# Altium project tsPico.PrjPcb
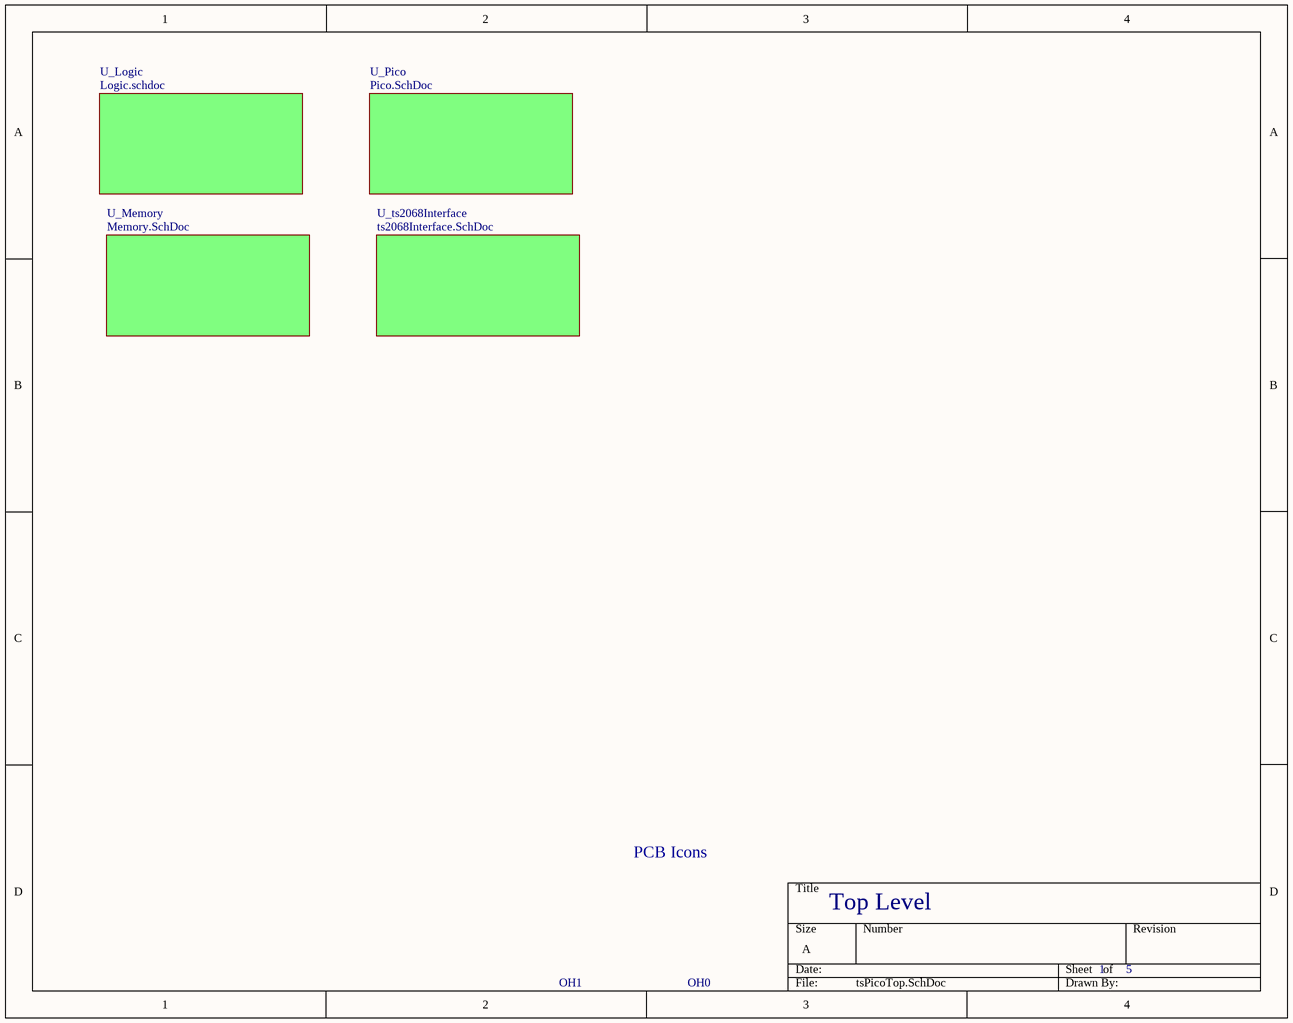
[diagram p0: tsPicoTop.SchDoc]
5 sheets, 38 parts. Net scope: global (net labels, ports and power ports of the same name join across sheets).
Sheets:
  tsPicoTop.SchDoc
    U_Logic = Logic.schdoc
    U_Memory = Memory.SchDoc
    U_Pico = Pico.SchDoc
    U_ts2068Interface = ts2068Interface.SchDoc

## Sheet tsPicoTop.SchDoc
size A; SheetNumber: 1; SheetTotal: 5

### Parts
OH0  OPENHW_PCB  [OpenHW]  (value not drawn)
OH1  OPENHW_SCH  (value not drawn)

### Sub-sheets
U_Logic = Logic.schdoc: no entries
U_Memory = Memory.SchDoc: no entries
U_Pico = Pico.SchDoc: no entries
U_ts2068Interface = ts2068Interface.SchDoc: no entries

### Notes on the sheet
- PCB Icons
- Top Level

## Sheet Logic.schdoc
size A; SheetNumber: 3; SheetTotal: 5
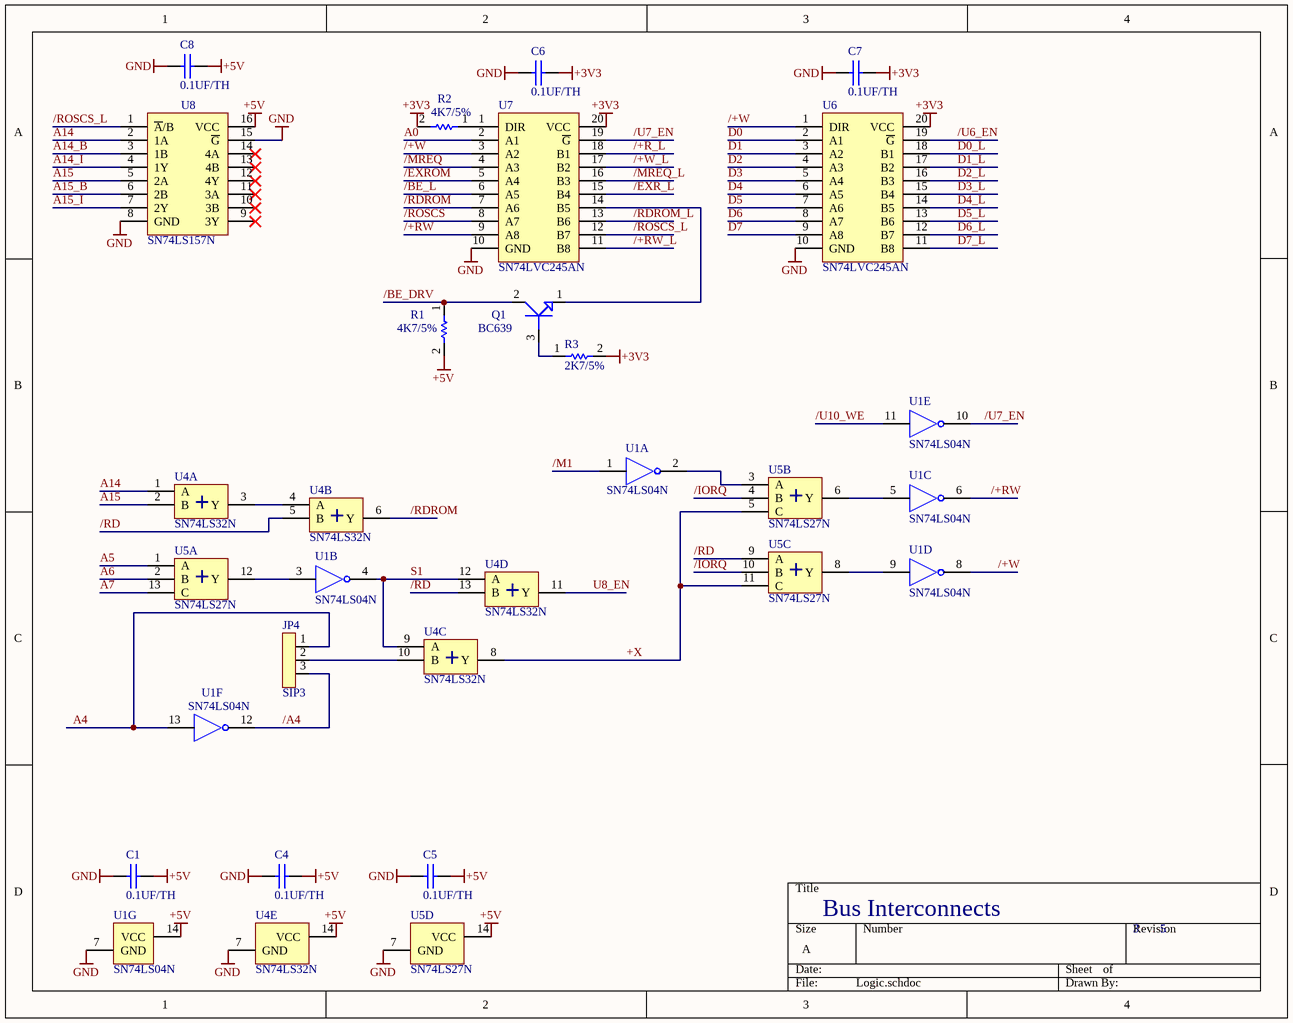
[diagram p1: Logic.schdoc]

### Parts
C1  0.1UF/TH  [CAPH5]
C4  0.1UF/TH  [CAPH5]
C5  0.1UF/TH  [CAPH5]
C6  0.1UF/TH  [CAPH5]
C7  0.1UF/TH  [CAPH5]
C8  0.1UF/TH  [CAPH5]
JP4  SIP3  [SIP3]
Q1  BC639  [TO92]
R1  4K7/5%  [CF18]
R2  4K7/5%  [CF18]
R3  2K7/5%  [CF18]
U1  SN74LS04N  [dip14]  (parts A,B,C,D,E,F,G of 7)
U4  SN74LS32N  [dip14]  (parts A,B,C,D,E of 5)
U5  SN74LS27N  [dip14]  (parts A,B,C,D of 4)
U6  SN74LVC245AN  [DIP20]
U7  SN74LVC245AN  [DIP20]
U8  SN74LS157N  [DIP16]

### Nets
+3V3: C6.2 C7.2 R2.2 R3.2 U6.20(VCC) U7.20(VCC)
+5V: C1.2 C4.2 C5.2 C8.2 R1.2 U1.14(VCC) U4.14(VCC) U5.14(VCC) U8.16(VCC)
GND: C1.1 C4.1 C5.1 C6.1 C7.1 C8.1 U1.7(GND) U4.7(GND) U5.7(GND) U6.10(GND) U7.10(GND) U8.8(GND) U8.15(~{G})
+X: U4.8(Y) U5.5(C) U5.11(C)
/+R_L: U7.18(B1)
/+RW: U1.6 U7.9(A8)
/+RW_L: U7.11(B8)
/+W: U1.8 U6.1(DIR) U7.3(A2)
/+W_L: U7.17(B2)
/A4: JP4.3 U1.12
/BE_DRV: Q1.2(COLLECTOR) R1.1
/BE_L: U7.6(A5)
/EXR_L: U7.15(B4)
/EXROM: U7.5(A4)
/IORQ: U5.4(B) U5.10(B)
/M1: U1.1
/MREQ: U7.4(A3)
/MREQ_L: U7.16(B3)
/RD: U4.5(B) U4.13(B) U5.9(A)
/RDROM: U4.6(Y) U7.7(A6)
/RDROM_L: U7.13(B6)
/ROSCS: U7.8(A7)
/ROSCS_L: U7.12(B7) U8.1(~{A}/B)
/U6_EN: U6.19(~{G})
/U7_EN: U1.10 U7.19(~{G})
/U10_WE: U1.11
A0: U7.2(A1)
A4: JP4.1 U1.13
A5: U5.1(A)
A6: U5.2(B)
A7: U5.13(C)
A14: U4.1(A) U8.2(1A)
A14_B: U8.3(1B)
A14_I: U8.4(1Y)
A15: U4.2(B) U8.5(2A)
A15_B: U8.6(2B)
A15_I: U8.7(2Y)
D0: U6.2(A1)
D0_L: U6.18(B1)
D1: U6.3(A2)
D1_L: U6.17(B2)
D2: U6.4(A3)
D2_L: U6.16(B3)
D3: U6.5(A4)
D3_L: U6.15(B4)
D4: U6.6(A5)
D4_L: U6.14(B5)
D5: U6.7(A6)
D5_L: U6.13(B6)
D6: U6.8(A7)
D6_L: U6.12(B7)
D7: U6.9(A8)
D7_L: U6.11(B8)
S1: U1.4 U4.9(A) U4.12(A)
U8_EN: U4.11(Y)
NetJP4_2: JP4.2 U4.10(B)
NetQ1_1: Q1.1(EMITTER) U7.14(B5)
NetQ1_3: Q1.3(BASE) R3.1
NetR2_1: R2.1 U7.1(DIR)
NetU1_2: U1.2 U5.3(A)
NetU1_3: U1.3 U5.12(Y)
NetU1_5: U1.5 U5.6(Y)
NetU1_9: U1.9 U5.8(Y)
NetU4_3: U4.3(Y) U4.4(A)

Not connected (* = marked no-connect by the designer): U8 9(3Y)* 10(3B)* 11(3A)* 12(4Y)* 13(4B)* 14(4A)*

### Notes on the sheet
- Bus Interconnects
- (in symbol SN74LS27N, part A) +
- (in symbol SN74LS27N, part B) +
- (in symbol SN74LS27N, part C) +
- (in symbol SN74LS32N, part A) +
- (in symbol SN74LS32N, part B) +
- (in symbol SN74LS32N, part C) +
- (in symbol SN74LS32N, part D) +

### Library data of the parts
C1 C4-C8 = 0.1UF/TH: 0.1 µF ±10% 50V Ceramic Capacitor X7R Radial; MFG: Vishay; MFG PN: K104K10X7RF5UH5; DK PN: BC2665CT-ND; Price: 1.17
Q1 = BC639: Bipolar (BJT) Transistor NPN 80 V 1 A 200MHz 625 mW Through Hole TO-92 (TO-226); MFG: Infineon; MFG PN: BC639; Price: 0.58000
R1 R2 = 4K7/5%: RES 4.7K OHM 5% 1/8W AXIAL; MFG PN: CF18JT4K70; DK PN: CF18JT4K70CT-ND; MFG: Stackpole; Populate: *
R3 = 2K7/5%: RES 2.7K OHM 5% 1/8W AXIAL; MFG PN: CF18JT2K70; DK PN: CF18JT2K70CT-ND; MFG: Stackpole; FOOTPRINT: RNF14; Populate: *
U1 = SN74LS04N: Inverter IC 6 Channel 14-PDIP; MFG: TI; DK PN: 296-1629-5-ND; MFG PN: SN74LS04N; Price: 1.17
U4 = SN74LS32N: IC GATE OR 4CH 2-INP 14DIP; MFG: TI; DK PN: 296-1658-5-ND; MFG PN: SN74LS32N; Price: 1.17
U5 = SN74LS27N: NOR Gate IC 3 Channel 14-PDIP; MFG: TI; DK PN: 296-14890-5-ND; MFG PN: SN74LS27N; Price: 1.17
U6 U7 = SN74LVC245AN: Transceiver, Non-Inverting 1 Element 8 Bit per Element 3-State Output 20-PDIP; MFG: TI; DK PN: 296-8503-5-ND; MFG PN: SN74LVC245AN; Price: 1.17
U8 = SN74LS157N: IC MULTIPLEXER 4 X 2:1 16DIP; MFG: TI; DK PN: 296-1645-5-ND; MFG PN: SN74LS157N; Price: 1.17

## Sheet Memory.SchDoc
size A; SheetNumber: 4; SheetTotal: 5
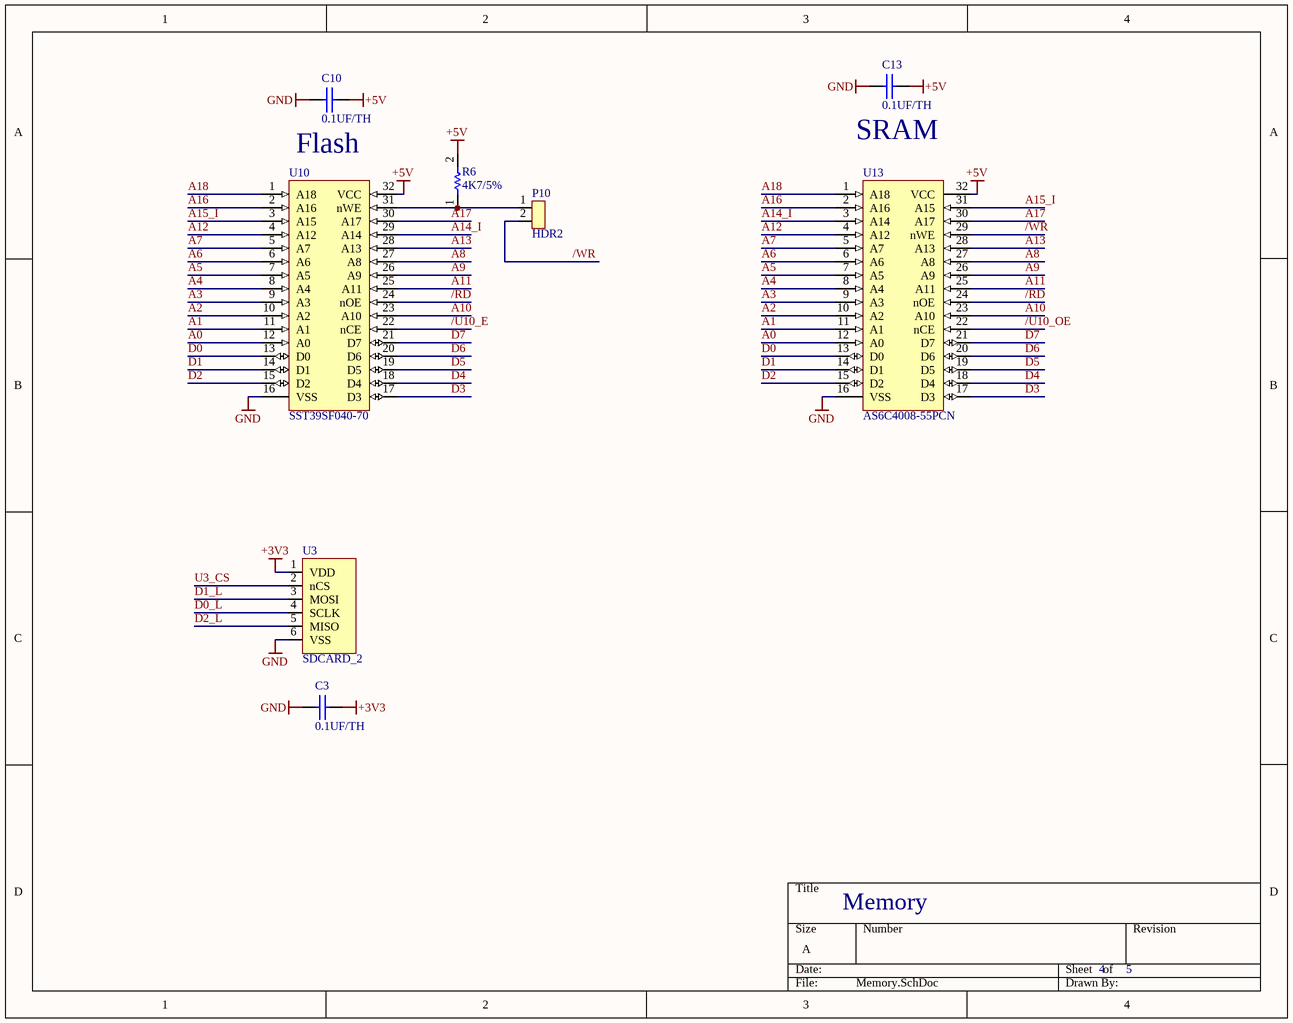
[diagram p2: Memory.SchDoc]

### Parts
C3  0.1UF/TH  [CAPH5]
C10  0.1UF/TH  [CAPH5]
C13  0.1UF/TH  [CAPH5]
P10  HDR2  [HDR2]
R6  4K7/5%  [CF18]
U3  SDCARD_2  [SDMODULE1_FLIPPED]
U10  SST39SF040-70  [DIP32]
U13  AS6C4008-55PCN  [DIP32]

### Nets
+3V3: C3.2 U3.1(VDD)
+5V: C10.2 C13.2 R6.2 U10.32(VCC) U13.32(VCC)
GND: C3.1 C10.1 C13.1 U3.6(VSS) U10.16(VSS) U13.16(VSS)
/RD: U10.24(nOE) U13.24(nOE)
/U10_E: U10.22(nCE)
/U10_OE: U13.22(nCE)
/WR: P10.2 U13.29(nWE)
A0: U10.12(A0) U13.12(A0)
A1: U10.11(A1) U13.11(A1)
A2: U10.10(A2) U13.10(A2)
A3: U10.9(A3) U13.9(A3)
A4: U10.8(A4) U13.8(A4)
A5: U10.7(A5) U13.7(A5)
A6: U10.6(A6) U13.6(A6)
A7: U10.5(A7) U13.5(A7)
A8: U10.27(A8) U13.27(A8)
A9: U10.26(A9) U13.26(A9)
A10: U10.23(A10) U13.23(A10)
A11: U10.25(A11) U13.25(A11)
A12: U10.4(A12) U13.4(A12)
A13: U10.28(A13) U13.28(A13)
A14_I: U10.29(A14) U13.3(A14)
A15_I: U10.3(A15) U13.31(A15)
A16: U10.2(A16) U13.2(A16)
A17: U10.30(A17) U13.30(A17)
A18: U10.1(A18) U13.1(A18)
D0: U10.13(D0) U13.13(D0)
D0_L: U3.4(SCLK)
D1: U10.14(D1) U13.14(D1)
D1_L: U3.3(MOSI)
D2: U10.15(D2) U13.15(D2)
D2_L: U3.5(MISO)
D3: U10.17(D3) U13.17(D3)
D4: U10.18(D4) U13.18(D4)
D5: U10.19(D5) U13.19(D5)
D6: U10.20(D6) U13.20(D6)
D7: U10.21(D7) U13.21(D7)
U3_CS: U3.2(nCS)
NetP10_1: P10.1 R6.1 U10.31(nWE)

### Notes on the sheet
- Flash
- (near C13) SRAM
- Memory

### Library data of the parts
C3 C10 C13 = 0.1UF/TH: as C1 on sheet Logic; Price: 1.17
R6 = 4K7/5%: as R1 on sheet Logic; Populate: *
U3 = SDCARD_2: Micro SD card module; MFG: TE; MFG PN: 2041021-4; DK PN: A101492CT-ND; Price: 3.69; URL: https://www.amazon.com/dp/B0989SM146?psc=1&ref=ppx_yo2ov_dt_b_product_details
U10 = SST39SF040-70: FLASH Memory IC 4Mbit Parallel 70 ns 32-PDIP; MFG: Microchip; MFG PN: SST39SF040-70-4C-PHE; DK PN: SST39SF040-70-4C-PHE-ND; Price: 1.17
U13 = AS6C4008-55PCN: SRAM - Asynchronous Memory IC 4Mb (512K x 8) Parallel 55 ns 32-DIP; MFG: Alliance Memory, Inc.; DK PN: 1450-1027-ND; MFG PN: AS6C4008-55PCN; Price: 1.17

## Sheet Pico.SchDoc: Mass Storage
size A; SheetNumber: 4; SheetTotal: 7
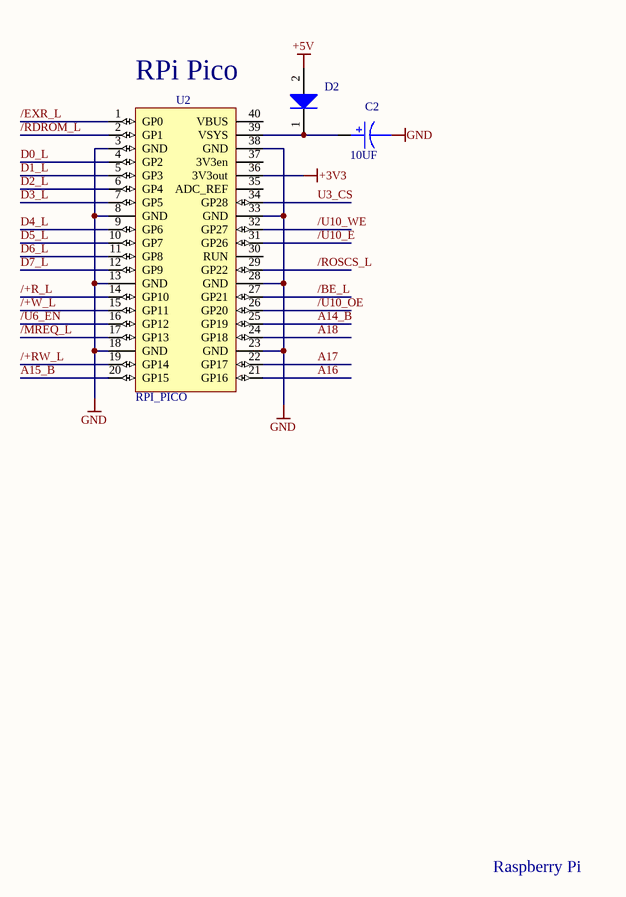
[diagram p3: Pico.SchDoc]

### Parts
C2  10UF  [CAP10EL]
D2  SB260_R2_00001  [DO-15]  (value not drawn)
U2  RPI_PICO  [RPIPICO]

### Nets
+3V3: U2.36(3V3out)
+5V: D2.2(A)
GND: C2.2 U2.3(GND) U2.8(GND) U2.13(GND) U2.18(GND) U2.23(GND) U2.28(GND) U2.33(GND) U2.38(GND)
/+R_L: U2.14(GP10)
/+RW_L: U2.19(GP14)
/+W_L: U2.15(GP11)
/BE_L: U2.27(GP21)
/EXR_L: U2.1(GP0)
/MREQ_L: U2.17(GP13)
/RDROM_L: U2.2(GP1)
/ROSCS_L: U2.29(GP22)
/U6_EN: U2.16(GP12)
/U10_E: U2.31(GP26)
/U10_OE: U2.26(GP20)
/U10_WE: U2.32(GP27)
A14_B: U2.25(GP19)
A15_B: U2.20(GP15)
A16: U2.21(GP16)
A17: U2.22(GP17)
A18: U2.24(GP18)
D0_L: U2.4(GP2)
D1_L: U2.5(GP3)
D2_L: U2.6(GP4)
D3_L: U2.7(GP5)
D4_L: U2.9(GP6)
D5_L: U2.10(GP7)
D6_L: U2.11(GP8)
D7_L: U2.12(GP9)
U3_CS: U2.34(GP28)
NetC2_1: C2.1 D2.1 U2.39(VSYS)

Not connected (* = marked no-connect by the designer): U2 30(RUN) 35(ADC_REF) 37(3V3en) 40(VBUS)

### Notes on the sheet
- RPi Pico
- Raspberry Pi

### Library data of the parts
C2 = 10UF: CAP ALUM 10UF 20% 16V RADIAL; MFG: Panasonic; MFG PN: ECE-A1CKA100; DK PN: P807-ND
D2 = SB260_R2_00001: DIODE SCHOTTKY 60V 2A DO15; DK PN: 3757-SB260_R2_00001CT-ND; MFG: Panjit; MFG PN: SB260_R2_00001; FOOTPRINT: DO15; Populate: *
U2 = RPI_PICO: RASPBERRY PI PICO RP2040 BOARD; MFG PN: SC0915; DK PN: 2648-SC0915CT-ND; MFG: Raspberry Pi; Populate: *

## Sheet ts2068Interface.SchDoc
size A; SheetNumber: 2; SheetTotal: 5
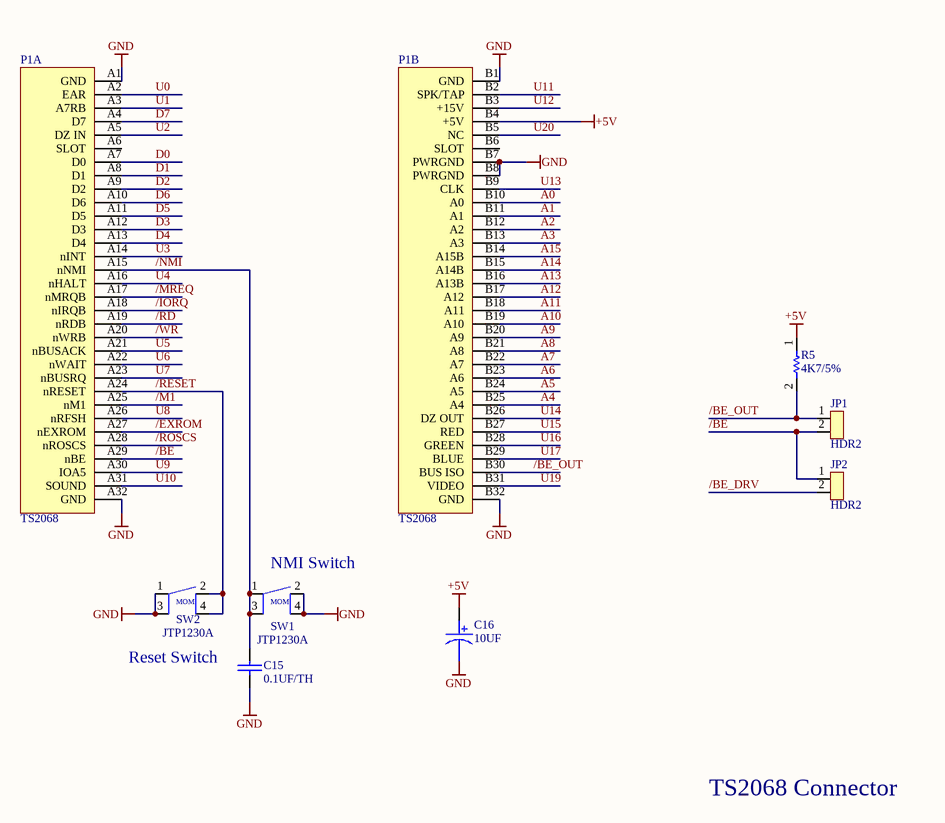
[diagram p4: ts2068Interface.SchDoc]

### Parts
C15  0.1UF/TH  [CAPH5]
C16  10UF  [CAP10EL]
JP1  HDR2  [HDR2]
JP2  HDR2  [HDR2]
P1  TS2068  [TS2068A]  (parts A,B of 2)
R5  4K7/5%  [CF18]
SW1  JTP1230A  [TACSW_6.5x4.5]
SW2  JTP1230A  [TACSW_6.5x4.5]

### Nets
+5V: C16.1 P1.B4(+5V) R5.1
GND: C15.1 C16.2 P1.A1(GND) P1.A32(GND) P1.B1(GND) P1.B7(PWRGND) P1.B8(PWRGND) P1.B32(GND) SW1.2 SW1.4 SW2.1 SW2.3
/BE: JP1.2 JP2.1 P1.A29(nBE)
/BE_DRV: JP2.2
/BE_OUT: JP1.1 P1.B30(BUS_ISO) R5.2
/EXROM: P1.A27(nEXROM)
/IORQ: P1.A18(nIRQB)
/M1: P1.A25(nM1)
/MREQ: P1.A17(nMRQB)
/NMI: C15.2 P1.A15(nNMI) SW1.1 SW1.3
/RD: P1.A19(nRDB)
/RESET: P1.A24(nRESET) SW2.2 SW2.4
/ROSCS: P1.A28(nROSCS)
/WR: P1.A20(nWRB)
A0: P1.B10(A0)
A1: P1.B11(A1)
A2: P1.B12(A2)
A3: P1.B13(A3)
A4: P1.B25(A4)
A5: P1.B24(A5)
A6: P1.B23(A6)
A7: P1.B22(A7)
A8: P1.B21(A8)
A9: P1.B20(A9)
A10: P1.B19(A10)
A11: P1.B18(A11)
A12: P1.B17(A12)
A13: P1.B16(A13B)
A14: P1.B15(A14B)
A15: P1.B14(A15B)
D0: P1.A7(D0)
D1: P1.A8(D1)
D2: P1.A9(D2)
D3: P1.A12(D3)
D4: P1.A13(D4)
D5: P1.A11(D5)
D6: P1.A10(D6)
D7: P1.A4(D7)
U0: P1.A2(EAR)
U1: P1.A3(A7RB)
U2: P1.A5(DZ_IN)
U3: P1.A14(nINT)
U4: P1.A16(nHALT)
U5: P1.A21(nBUSACK)
U6: P1.A22(nWAIT)
U7: P1.A23(nBUSRQ)
U8: P1.A26(nRFSH)
U9: P1.A30(IOA5)
U10: P1.A31(SOUND)
U11: P1.B2(SPK/TAP)
U12: P1.B3(+15V)
U13: P1.B9(CLK)
U14: P1.B26(DZ_OUT)
U15: P1.B27(RED)
U16: P1.B28(GREEN)
U17: P1.B29(BLUE)
U19: P1.B31(VIDEO)
U20: P1.B5(NC)

Not connected (* = marked no-connect by the designer): P1 A6(SLOT) B6(SLOT)

### Notes on the sheet
- (near SW1) NMI Switch
- (near C15) Reset Switch
- TS2068 Connector
- (in symbol JTP1230A) MOM

### Library data of the parts
C15 = 0.1UF/TH: as C1 on sheet Logic; Price: 1.17
C16 = 10UF: as C2 on sheet Pico
R5 = 4K7/5%: as R1 on sheet Logic; Populate: *
SW1 SW2 = JTP1230A: Tactile Switch SPST-NO Top Actuated Through Hole; MFG: Apem; DK PN: 679-2429-ND; MFG PN: JTP1230A
P1 = TS2068: Populate: *

## Nets that join several sheets
+3V3: Logic (6 pins), Memory (C3.2 U3.1), Pico (U2.36)
+5V: Logic (9 pins), Memory (5 pins), Pico (D2.2), ts2068Interface (C16.1 P1.B4 R5.1)
GND: Logic (13 pins), Memory (6 pins), Pico (9 pins), ts2068Interface (12 pins)
/+R_L: Logic (U7.18), Pico (U2.14)
/+RW_L: Logic (U7.11), Pico (U2.19)
/+W_L: Logic (U7.17), Pico (U2.15)
/BE_DRV: Logic (Q1.2 R1.1), ts2068Interface (JP2.2)
/BE_L: Logic (U7.6), Pico (U2.27)
/EXR_L: Logic (U7.15), Pico (U2.1)
/EXROM: Logic (U7.5), ts2068Interface (P1.A27)
/IORQ: Logic (U5.4 U5.10), ts2068Interface (P1.A18)
/M1: Logic (U1.1), ts2068Interface (P1.A25)
/MREQ: Logic (U7.4), ts2068Interface (P1.A17)
/MREQ_L: Logic (U7.16), Pico (U2.17)
/RD: Logic (U4.5 U4.13 U5.9), Memory (U10.24 U13.24), ts2068Interface (P1.A19)
/RDROM_L: Logic (U7.13), Pico (U2.2)
/ROSCS: Logic (U7.8), ts2068Interface (P1.A28)
/ROSCS_L: Logic (U7.12 U8.1), Pico (U2.29)
/U6_EN: Logic (U6.19), Pico (U2.16)
/U10_E: Memory (U10.22), Pico (U2.31)
/U10_OE: Memory (U13.22), Pico (U2.26)
/U10_WE: Logic (U1.11), Pico (U2.32)
/WR: Memory (P10.2 U13.29), ts2068Interface (P1.A20)
A0: Logic (U7.2), Memory (U10.12 U13.12), ts2068Interface (P1.B10)
A1: Memory (U10.11 U13.11), ts2068Interface (P1.B11)
A2: Memory (U10.10 U13.10), ts2068Interface (P1.B12)
A3: Memory (U10.9 U13.9), ts2068Interface (P1.B13)
A4: Logic (JP4.1 U1.13), Memory (U10.8 U13.8), ts2068Interface (P1.B25)
A5: Logic (U5.1), Memory (U10.7 U13.7), ts2068Interface (P1.B24)
A6: Logic (U5.2), Memory (U10.6 U13.6), ts2068Interface (P1.B23)
A7: Logic (U5.13), Memory (U10.5 U13.5), ts2068Interface (P1.B22)
A8: Memory (U10.27 U13.27), ts2068Interface (P1.B21)
A9: Memory (U10.26 U13.26), ts2068Interface (P1.B20)
A10: Memory (U10.23 U13.23), ts2068Interface (P1.B19)
A11: Memory (U10.25 U13.25), ts2068Interface (P1.B18)
A12: Memory (U10.4 U13.4), ts2068Interface (P1.B17)
A13: Memory (U10.28 U13.28), ts2068Interface (P1.B16)
A14: Logic (U4.1 U8.2), ts2068Interface (P1.B15)
A14_B: Logic (U8.3), Pico (U2.25)
A14_I: Logic (U8.4), Memory (U10.29 U13.3)
A15: Logic (U4.2 U8.5), ts2068Interface (P1.B14)
A15_B: Logic (U8.6), Pico (U2.20)
A15_I: Logic (U8.7), Memory (U10.3 U13.31)
A16: Memory (U10.2 U13.2), Pico (U2.21)
A17: Memory (U10.30 U13.30), Pico (U2.22)
A18: Memory (U10.1 U13.1), Pico (U2.24)
D0: Logic (U6.2), Memory (U10.13 U13.13), ts2068Interface (P1.A7)
D0_L: Logic (U6.18), Memory (U3.4), Pico (U2.4)
D1: Logic (U6.3), Memory (U10.14 U13.14), ts2068Interface (P1.A8)
D1_L: Logic (U6.17), Memory (U3.3), Pico (U2.5)
D2: Logic (U6.4), Memory (U10.15 U13.15), ts2068Interface (P1.A9)
D2_L: Logic (U6.16), Memory (U3.5), Pico (U2.6)
D3: Logic (U6.5), Memory (U10.17 U13.17), ts2068Interface (P1.A12)
D3_L: Logic (U6.15), Pico (U2.7)
D4: Logic (U6.6), Memory (U10.18 U13.18), ts2068Interface (P1.A13)
D4_L: Logic (U6.14), Pico (U2.9)
D5: Logic (U6.7), Memory (U10.19 U13.19), ts2068Interface (P1.A11)
D5_L: Logic (U6.13), Pico (U2.10)
D6: Logic (U6.8), Memory (U10.20 U13.20), ts2068Interface (P1.A10)
D6_L: Logic (U6.12), Pico (U2.11)
D7: Logic (U6.9), Memory (U10.21 U13.21), ts2068Interface (P1.A4)
D7_L: Logic (U6.11), Pico (U2.12)
U3_CS: Memory (U3.2), Pico (U2.34)